# Altium schematic sheet ALIMENTACION.SchDoc
size A4
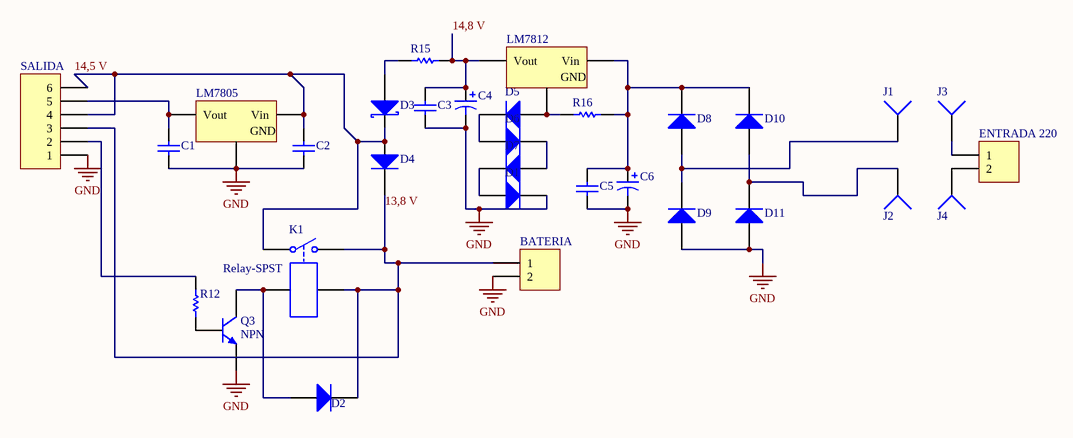
[diagram p0: ALIMENTACION.SchDoc]

## Parts
BATERIA  Header 2  [Bornera 2 pin]  (value not drawn)
C1  Cap  [C Disc 8x2.5-5.0]  (value not drawn)
C2  Cap  [C Disc 8x2.5-5.0]  (value not drawn)
C3  Cap  [C Disc 8x2.5-5.0]  (value not drawn)
C4  Cap Pol1  [RB7.6-15]  (value not drawn)
C5  Cap  [C Disc 8x2.5-5.0]  (value not drawn)
C6  Cap Pol1  [RB7.6-15]  (value not drawn)
D1  Diode 1N914  [DO-35 Glass]  (value not drawn)
D2  Diode 1N914  [DO-35 Glass]  (value not drawn)
D3  D Schottky  [DO-35 Glass]  (value not drawn)
D4  Diode 1N914  [DO-35 Glass]  (value not drawn)
D5  Diode 1N914  [DO-35 Glass]  (value not drawn)
D6  Diode 1N914  [DO-35 Glass]  (value not drawn)
D7  Diode 1N914  [DO-35 Glass]  (value not drawn)
D8  Diode 1N914  [DO-35 Glass]  (value not drawn)
D9  Diode 1N914  [DO-35 Glass]  (value not drawn)
D10  Diode 1N914  [DO-35 Glass]  (value not drawn)
D11  Diode 1N914  [DO-35 Glass]  (value not drawn)
ENTRADA_220  220V  [Bornera 2 pin]  (value not drawn)
J1  Socket  [PIN1]  (value not drawn)
J2  Socket  [PIN1]  (value not drawn)
J3  Socket  [PIN1]  (value not drawn)
J4  Socket  [PIN1]  (value not drawn)
K1  Relay-SPST  [MODULE4]
LM7805  Volt Reg  [TO-220AB]  (value not drawn)
LM7812  Volt Reg  [TO-220AB]  (value not drawn)
Q3  NPN  [TO-226-AA]
R12  Res1  [R Axial 0.4]  (value not drawn)
R15  Res1  [AXIAL-0.3]  (value not drawn)
R16  Res1  [AXIAL-0.3]  (value not drawn)
SALIDA  Header 6  [BORNERA 6 PIN]  (value not drawn)

## Nets
GND: BATERIA.2 C1.1 C2.1 C3.1 C4.2 C5.1 C6.2 D1.2(K) D9.1(A) D11.1(A) LM7805.2(GND) Q3.3(E) SALIDA.1
13,8 V: BATERIA.1 D2.2(K) D4.2(K) K1.2 K1.4 SALIDA.3
14,5 V: C2.2 D3.2(K) D4.1(A) K1.1 LM7805.1(Vin) SALIDA.4 SALIDA.6
14,8 V: C3.2 C4.1 LM7812.3(Vout) R15.2
NetC1_2: C1.2 LM7805.3(Vout) SALIDA.5
NetC5_2: C5.2 C6.1 D8.2(K) D10.2(K) LM7812.1(Vin) R16.2
NetD1_1: D1.1(A) D7.2(K)
NetD2_1: D2.1(A) K1.3 Q3.1(C)
NetD3_1: D3.1(A) R15.1
NetD5_1: D5.1(A) LM7812.2(GND) R16.1
NetD5_2: D5.2(K) D6.1(A)
NetD6_2: D6.2(K) D7.1(A)
NetD8_1: D8.1(A) D9.2(K) J1.1
NetD10_1: D10.1(A) D11.2(K) J2.1
NetENTRADA_220_1: ENTRADA_220.1 J3.1
NetENTRADA_220_2: ENTRADA_220.2 J4.1
NetQ3_2: Q3.2(B) R12.2
NetR12_1: R12.1 SALIDA.2

## Library data of the parts
BATERIA ENTRADA_220 = Header 2: Header, 2-Pin; LatestRevisionDate: 17-Jul-2002; LatestRevisionNote: Re-released for DXP Platform.; Publisher: Altium Limited
C1-C3 C5 = Cap: Capacitor; Value: 100pF; Published: 8-Jun-2000; LatestRevisionDate: 17-Jul-2002; LatestRevisionNote: Re-released for DXP Platform.; PackageReference: RAD-0.3; Publisher: Altium Limited; PackageDescription: Radial Cap, Thru-Hole; 2 Leads; 0.3 in Pin Spacing
C4 C6 = Cap Pol1: Polarized Capacitor (Radial); Value: 100pF; Published: 8-Jun-2000; LatestRevisionDate: 17-Jul-2002; LatestRevisionNote: Re-released for DXP Platform.; PackageReference: RB7.6-15; Publisher: Altium Limited; PackageDescription: Polarized Capacitor (Radial); 2 Leads
D1 D2 D4-D11 = Diode 1N914: High Conductance Fast Diode; Published: 8-Jun-2000; LatestRevisionDate: 17-Jul-2002; LatestRevisionNote: Re-released for DXP Platform.; DatasheetVersion: 1997; PackageReference: DO-35; Publisher: Altium Limited; PackageDescription: Diode, Axial; Body 3.8 x 1.9 mm (LxDia. max), Lead Dia. 0.53 mm (max); Code_JEDEC: DO-204-AH; ComponentLink1Description: Manufacturer Link; ComponentLink1URL: http://www.fairchildsemi.com/; ComponentLink2Description: Datasheet; ComponentLink2URL: http://www.fairchildsemi.com/ds/1N%2F1N4448.pdf
D3 = D Schottky: Schottky Diode; Published: 8-Jun-2000; LatestRevisionDate: 17-Jul-2002; LatestRevisionNote: Re-released for DXP Platform.; PackageReference: SMB; Publisher: Altium Limited; PackageDescription: DO-214-AA/SMB; 2 C-Bend Leads; Body 5.3 x 3.6 mm, inc. leads (LxW); Code_JEDEC: DO-214-AA
K1 = Relay-SPST: Single-Pole Single-Throw Relay; Published: 24-Mar-1999; LatestRevisionDate: 17-Jul-2002; LatestRevisionNote: Re-released for DXP Platform.; PackageReference: MODULE4; Publisher: Altium Limited
LM7805 LM7812 = Volt Reg: Voltage Regulator; Published: 24-Mar-1999; LatestRevisionDate: 29-May-2009; LatestRevisionNote: IPC-7351 Footprint Added.; PackageReference: D2PAK; Publisher: Altium Limited; PackageDescription: 3-Pin Transistor Outline Package 2.54 mm Pitch, 15.1 mm Lead Span
Q3 = NPN: NPN Bipolar Transistor; Published: 8-Jun-2000; LatestRevisionDate: 17-Jul-2002; LatestRevisionNote: Re-released for DXP Platform.; PackageReference: TO-226-AA; Publisher: Altium Limited; PackageDescription: TO, Flat Index; 3 In-Line, Axial Leads; Body Dia. 4.8mm; Leads 0.55 x 0.51 mm (max); Code_JEDEC: TO-226-AA
R12 R15 R16 = Res1: Resistor; Value: 1K; Published: 8-Jun-2000; LatestRevisionDate: 17-Jul-2002; LatestRevisionNote: Re-released for DXP Platform.; PackageReference: AXIAL-0.3; Publisher: Altium Limited; PackageDescription: Axial Device, Thru-Hole; 2 Leads; 0.3 in Pin Spacing
SALIDA = Header 6: Header, 6-Pin; pin to pad: 1>6 2>5 3>4 4>3 5>2 6>1; LatestRevisionDate: 17-Jul-2002; LatestRevisionNote: Re-released for DXP Platform.; Publisher: Altium Limited
J1-J4 = Socket: LatestRevisionDate: 17-Jul-2002; LatestRevisionNote: Re-released for DXP Platform.; Publisher: Altium Limited